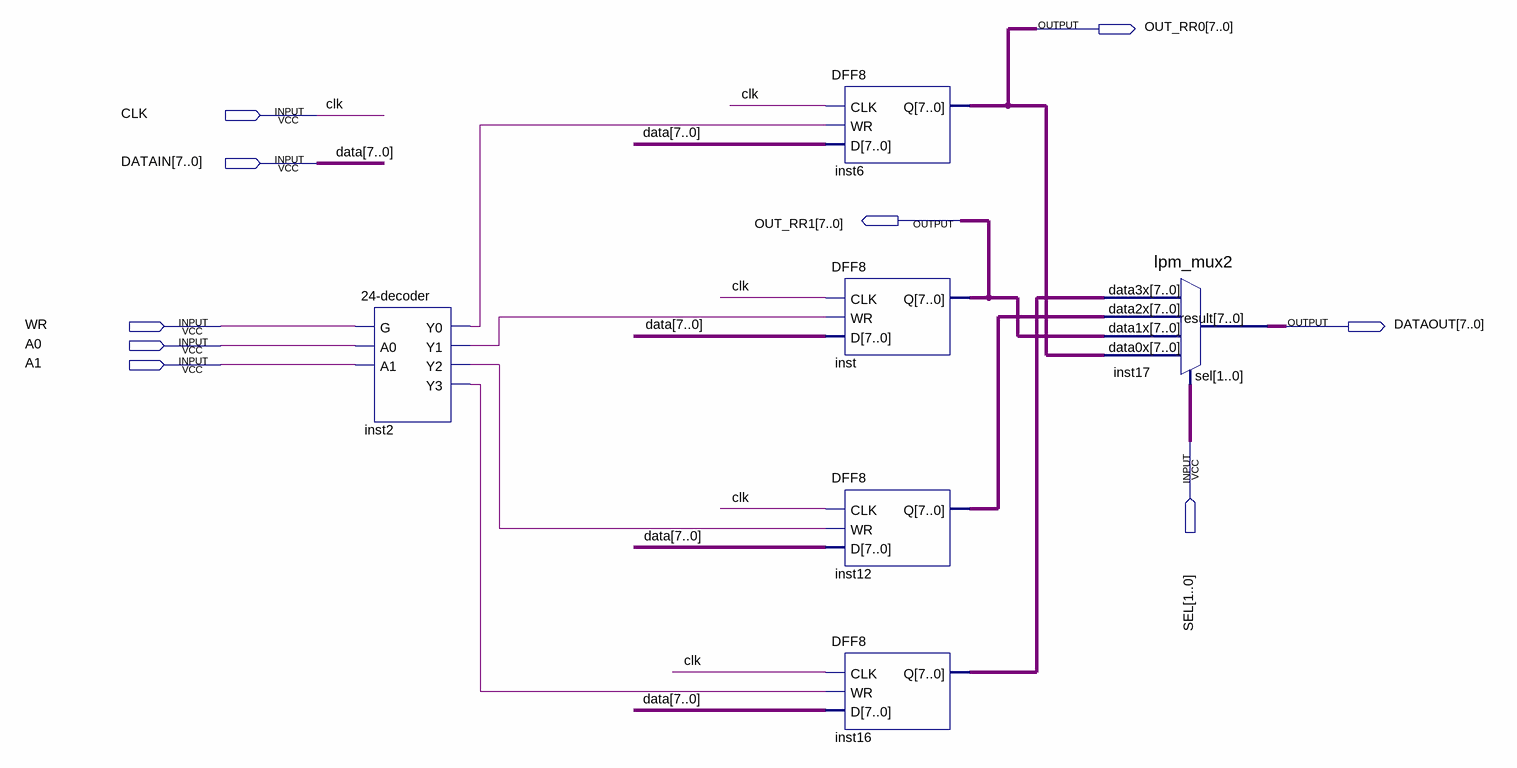
[diagram p0: schematic sheet]
// Quartus schematic register-heap.bdf as structural Verilog: 6 symbols, 9 pins
module \register-heap  (
  input  CLK,
  input  [7:0] DATAIN,
  input  WR,
  input  A0,
  input  A1,
  input  [1:0] SEL,
  output [7:0] OUT_RR0,
  output [7:0] OUT_RR1,
  output [7:0] DATAOUT
);

  wire inst2_y0, inst2_y1, inst2_y2, inst2_y3;
  wire [7:0] inst12_q, inst16_q;

  \24-decoder  inst2 (.G(WR), .A0(A0), .A1(A1), .Y0(inst2_y0), .Y1(inst2_y1), .Y2(inst2_y2), .Y3(inst2_y3));
  DFF8 inst6 (.CLK(CLK), .WR(inst2_y0), .D(DATAIN), .Q(OUT_RR0));
  DFF8 inst (.CLK(CLK), .WR(inst2_y1), .D(DATAIN), .Q(OUT_RR1));
  DFF8 inst12 (.CLK(CLK), .WR(inst2_y2), .D(DATAIN), .Q(inst12_q));
  DFF8 inst16 (.CLK(CLK), .WR(inst2_y3), .D(DATAIN), .Q(inst16_q));
  lpm_mux2 inst17 (
    .data3x(inst16_q), .data2x(inst12_q), .data1x(OUT_RR1), .data0x(OUT_RR0), .sel(SEL), .result(DATAOUT));

  // Other names for the same wires on the sheet: data[7:0] = DATAIN
endmodule
